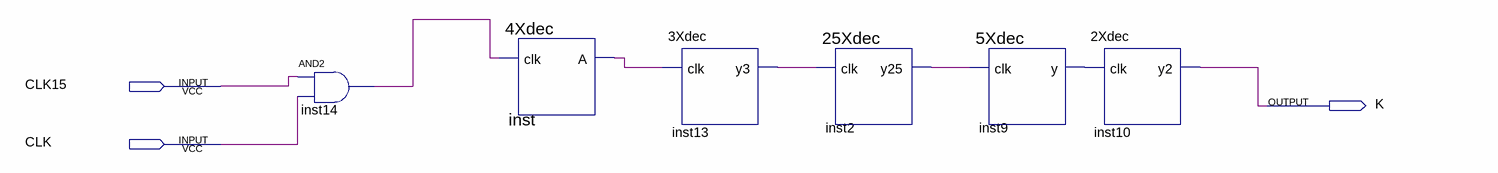
[diagram p0: schematic sheet]
// Quartus schematic test.bdf as structural Verilog: 6 symbols, 3 pins
module test (
  input  CLK15,
  input  CLK,
  output K
);

  wire inst2_y25, inst9_y, inst13_y3, inst14_out, inst_a;

  and inst14 (inst14_out, CLK15, CLK);
  \4Xdec  inst (.clk(inst14_out), .A(inst_a));
  \3Xdec  inst13 (.clk(inst_a), .y3(inst13_y3));
  \25Xdec  inst2 (.clk(inst13_y3), .y25(inst2_y25));
  \5Xdec  inst9 (.clk(inst2_y25), .y(inst9_y));
  \2Xdec  inst10 (.clk(inst9_y), .y2(K));
endmodule
